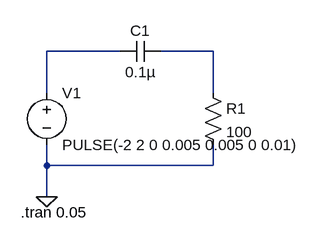
[diagram p0: schematic Draft3.asc]
Draft3.asc, the LTspice schematic file:
Version 4
SHEET 1 880 680
WIRE 192 80 80 80
WIRE 336 80 256 80
WIRE 80 144 80 80
WIRE 336 144 336 80
WIRE 80 256 80 224
WIRE 336 256 336 224
WIRE 336 256 80 256
WIRE 80 304 80 256
FLAG 80 304 0
SYMBOL voltage 80 128 R0
WINDOW 123 0 0 Left 0
WINDOW 39 0 0 Left 0
SYMATTR InstName V1
SYMATTR Value PULSE(-2 2 0 0.005 0.005 0 0.01)
SYMBOL res 320 128 R0
SYMATTR InstName R1
SYMATTR Value 100
SYMBOL cap 256 64 R90
WINDOW 0 0 32 VBottom 2
WINDOW 3 32 32 VTop 2
SYMATTR InstName C1
SYMATTR Value 0.1µ
TEXT 40 328 Left 2 !.tran 0.05

The netlist it stands for:
* Draft3.asc
V1 N001 0 PULSE(-2 2 0 0.005 0.005 0 0.01)
R1 N002 0 100
C1 N002 N001 0.1µ
.tran 0.05
.backanno
.end